# Altium schematic sheet main.SchDoc
size A3
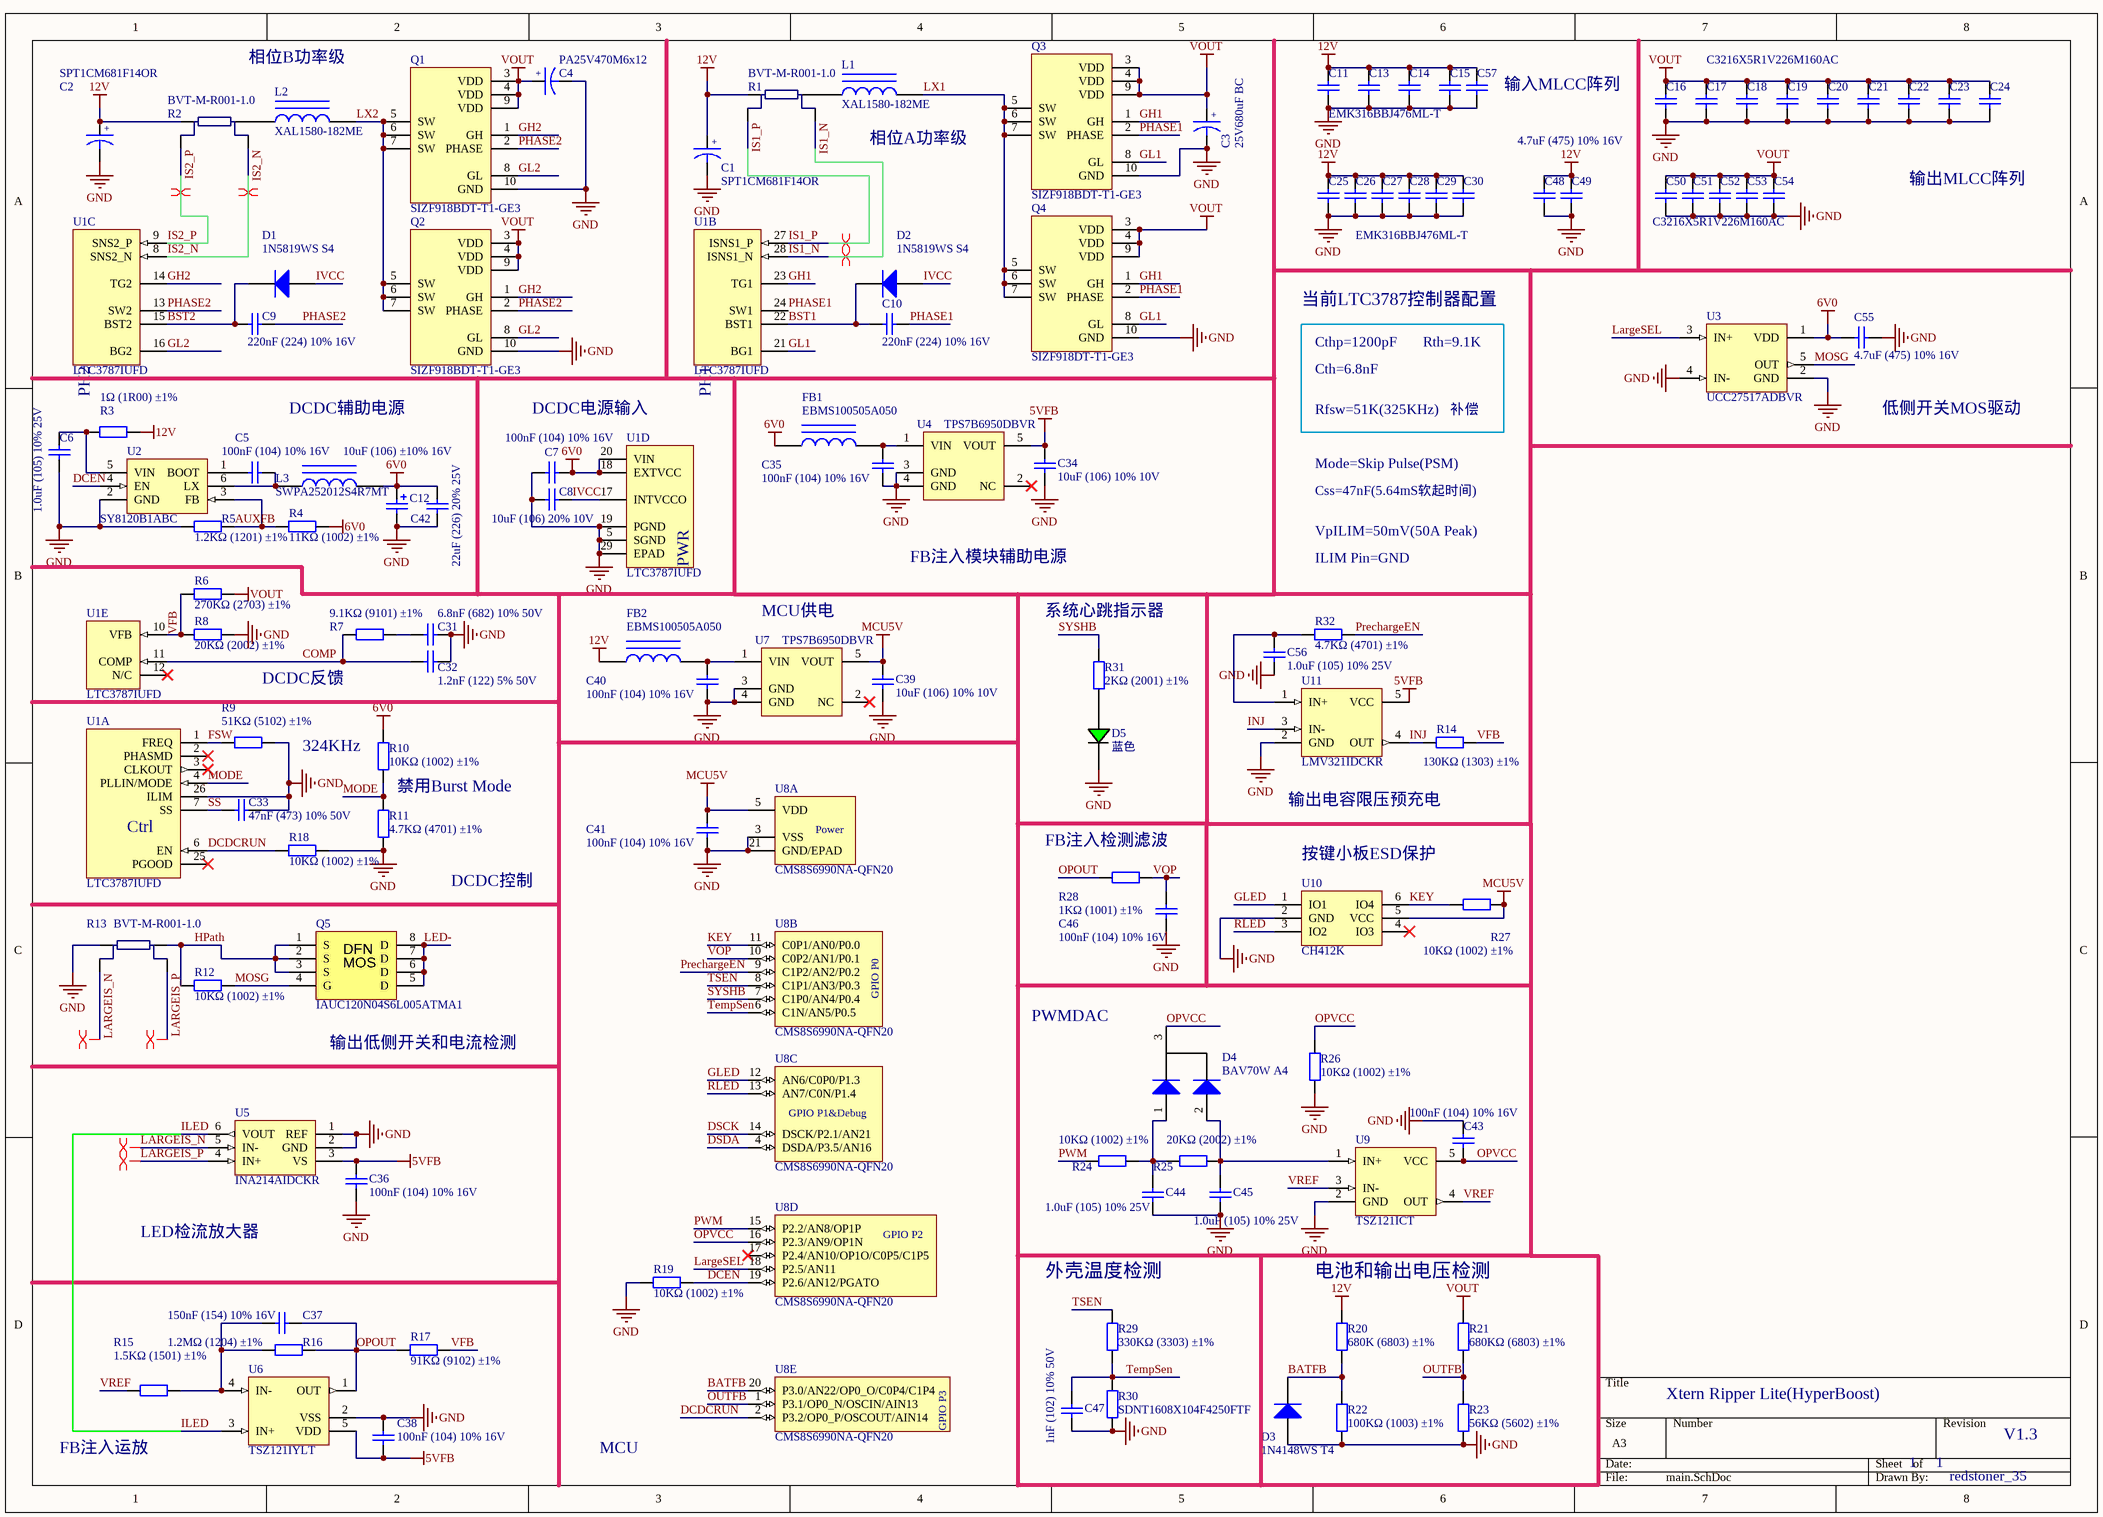
[diagram p0: main.SchDoc]

## Parts
C1  SPT1CM681F14OR  [ElecCap_Hori]
C2  SPT1CM681F14OR  [ElecCap_Hori]
C3  25V680uF BC  [ElecCap_Hori]
C4  PA25V470M6x12  [ElecCap_Hori]
C5  100nF (104) 10% 16V  [0402_C]
C6  1.0uF (105) 10% 25V  [0402_C]
C7  100nF (104) 10% 16V  [0402_C]
C8  10uF (106) 20% 10V  [0402_C]
C9  220nF (224) 10% 16V  [0402_C]
C10  220nF (224) 10% 16V  [0402_C]
C11  EMK316BBJ476ML-T  [1206C]
C12  10uF (106) ±10% 16V  [CASE-A_3216]
C13  EMK316BBJ476ML-T  [1206C]  (value not drawn)
C14  EMK316BBJ476ML-T  [1206C]  (value not drawn)
C15  EMK316BBJ476ML-T  [1206C]  (value not drawn)
C16  C3216X5R1V226M160AC  [1206C]
C17  C3216X5R1V226M160AC  [1206C]  (value not drawn)
C18  C3216X5R1V226M160AC  [1206C]  (value not drawn)
C19  C3216X5R1V226M160AC  [1206C]  (value not drawn)
C20  C3216X5R1V226M160AC  [1206C]  (value not drawn)
C21  C3216X5R1V226M160AC  [1206C]  (value not drawn)
C22  C3216X5R1V226M160AC  [1206C]  (value not drawn)
C23  C3216X5R1V226M160AC  [1206C]  (value not drawn)
C24  C3216X5R1V226M160AC  [1206C]  (value not drawn)
C25  EMK316BBJ476ML-T  [1206C]
C26  EMK316BBJ476ML-T  [1206C]  (value not drawn)
C27  EMK316BBJ476ML-T  [1206C]  (value not drawn)
C28  EMK316BBJ476ML-T  [1206C]  (value not drawn)
C29  EMK316BBJ476ML-T  [1206C]  (value not drawn)
C30  EMK316BBJ476ML-T  [1206C]  (value not drawn)
C31  6.8nF (682) 10% 50V  [0402_C]
C32  1.2nF (122) 5% 50V  [0402_C]
C33  47nF (473) 10% 50V  [0402_C]
C34  10uF (106) 10% 10V  [0603_C]
C35  100nF (104) 10% 16V  [0402_C]
C36  100nF (104) 10% 16V  [0402_C]
C37  150nF (154) 10% 16V  [0402_C]
C38  100nF (104) 10% 16V  [0402_C]
C39  10uF (106) 10% 10V  [0603_C]
C40  100nF (104) 10% 16V  [0402_C]
C41  100nF (104) 10% 16V  [0402_C]
C42  22uF (226) 20% 25V  [0805_C]
C43  100nF (104) 10% 16V  [0402_C]
C44  1.0uF (105) 10% 25V  [0402_C]
C45  1.0uF (105) 10% 25V  [0402_C]
C46  100nF (104) 10% 16V  [0402_C]
C47  1nF (102) 10% 50V  [0402_C]
C48  4.7uF (475) 10% 16V  [0603_C]  (value not drawn)
C49  4.7uF (475) 10% 16V  [0603_C]
C50  C3216X5R1V226M160AC  [1206C]
C51  C3216X5R1V226M160AC  [1206C]  (value not drawn)
C52  C3216X5R1V226M160AC  [1206C]  (value not drawn)
C53  C3216X5R1V226M160AC  [1206C]  (value not drawn)
C54  C3216X5R1V226M160AC  [1206C]  (value not drawn)
C55  4.7uF (475) 10% 16V  [0603_C]
C56  1.0uF (105) 10% 25V  [0402_C]
C57  EMK316BBJ476ML-T  [1206C]  (value not drawn)
D1  1N5819WS S4  [SOD-323]
D2  1N5819WS S4  [SOD-323]
D3  1N4148WS T4  [SOD-323]
D4  BAV70W A4  [SC70-3]
D5  蓝色  [LED-0402]
FB1  EBMS100505A050  [0402_L]
FB2  EBMS100505A050  [0402_L]
L1  XAL1580-182ME  [XAL1580_xxxME]
L2  XAL1580-182ME  [XAL1580_xxxME]
L3  SWPA252012S4R7MT  [SWPA252010S]
Q1  SIZF918BDT-T1-GE3  [AOE6936]
Q2  SIZF918BDT-T1-GE3  [AOE6936]
Q3  SIZF918BDT-T1-GE3  [AOE6936]
Q4  SIZF918DT-T1-GE3  [AOE6936]
Q5  IAUC120N04S6L005ATMA1  [SON/DFN5x6(MOS)]
R1  BVT-M-R001-1.0  [2512-Virtual4Wire]
R2  BVT-M-R001-1.0  [2512-Virtual4Wire]
R3  1Ω (1R00) ±1%  [0402_R]
R4  11KΩ (1002) ±1%  [0402_R]
R5  1.2KΩ (1201) ±1%  [0402_R]
R6  270KΩ (2703) ±1%  [0402_R]
R7  9.1KΩ (9101) ±1%  [0402_R]
R8  20KΩ (2002) ±1%  [0402_R]
R9  51KΩ (5102) ±1%  [0402_R]
R10  10KΩ (1002) ±1%  [0402_R]
R11  4.7KΩ (4701) ±1%  [0402_R]
R12  10KΩ (1002) ±1%  [0402_R]
R13  BVT-M-R001-1.0  [2512-Virtual4Wire]
R14  130KΩ (1303) ±1%  [0402_R]
R15  1.5KΩ (1501) ±1%  [0402_R]
R16  1.2MΩ (1204) ±1%  [0402_R]
R17  91KΩ (9102) ±1%  [0402_R]
R18  10KΩ (1002) ±1%  [0402_R]
R19  10KΩ (1002) ±1%  [0402_R]
R20  680K (6803) ±1%  [0402_R]
R21  680KΩ (6803) ±1%  [0402_R]
R22  100KΩ (1003) ±1%  [0402_R]
R23  56KΩ (5602) ±1%  [0402_R]
R24  10KΩ (1002) ±1%  [0402_R]
R25  20KΩ (2002) ±1%  [0402_R]
R26  10KΩ (1002) ±1%  [0402_R]
R27  10KΩ (1002) ±1%  [0402_R]
R28  1KΩ (1001) ±1%  [0402_R]
R29  330KΩ (3303) ±1%  [0402_R]
R30  SDNT1608X104F4250FTF  [0603_R]
R31  2KΩ (2001) ±1%  [0402_R]
R32  4.7KΩ (4701) ±1%  [0402_R]
U1  LTC3787IUFD  [UFD-QFN28]  (parts A,B,C,D,E of 5)
U2  SY8120B1ABC  [SOT95P245X110-6N]
U3  UCC27517ADBVR  [SOT95P245X110-5N]
U4  TPS7B6950DBVR  [SOT95P245X110-5N]
U5  INA214AIDCKR  [SC70-6]
U6  TSZ121IYLT  [SOT95P245X110-5N]
U7  TPS7B6950DBVR  [SOT95P245X110-5N]
U8  CMS8S6990NA-QFN20  [QFN40P300X300X800_HS-21N]  (parts A,B,C,D,E of 5)
U9  TSZ121ICT  [SC70-5]
U10  CH412K  [SC70-6]
U11  LMV321IDCKR  [SC70-5]

## Nets
5VFB: C34.2 C36.2 C38.1 U4.5(VOUT) U5.3(VS) U6.5(VDD) U11.5(VCC)
6V0: C7.2 C12.1 C42.2 C55.1 FB1.1 L3.1 R4.1 R10.2 U1.18(EXTVCC) U1.20(VIN) U3.1(VDD)
12V: C1.1 C2.1 C11.2 C13.2 C14.2 C15.2 C25.2 C26.2 C27.2 C28.2 C29.2 C30.2 C48.2 C49.2 C57.2 FB2.1 R1.0(CIN) R2.1(CIN) R3.2 R20.2
GND: C1.2 C2.2 C3.2 C4.2 C6.1 C7.1 C8.1 C11.1 C12.2 C13.1 C14.1 C15.1 C16.1 C17.1 C18.1 C19.1 C20.1 C21.1 C22.1 C23.1 C24.1 C25.1 C26.1 C27.1 C28.1 C29.1 C30.1 C31.2 C32.1 C33.2 C34.1 C35.1 C36.1 C38.2 C39.1 C40.1 C41.1 C42.1 C43.1 C44.1 C45.1 C46.1 C47.1 C48.1 C49.1 C50.1 C51.1 C52.1 C53.1 C54.1 C55.2 C56.1 C57.1 D3.1(A) D5.K Q1.10(GND) Q2.10(GND) Q3.10(GND) Q4.10(GND) R5.2 R8.2 R9.2 R11.1 R13.0(CIN) R18.2 R19.1 R22.1 R23.1 R26.1 R30.2 U1.5(SGND) U1.19(PGND) U1.26(ILIM) U1.29(EPAD) U2.2(GND) U3.2(GND) U3.4(IN-) U4.3(GND) U4.4(GND) U5.1(REF) U5.2(GND) U6.2(VSS) U7.3(GND) U7.4(GND) U8.3(VSS) U8.21(GND/EPAD) U9.2(GND) U10.2(GND) U11.2(GND)
MCU5V: C39.2 C41.2 R27.2 U7.5(VOUT) U8.5(VDD) U10.5(VCC)
VOUT: C3.1 C4.1 C16.2 C17.2 C18.2 C19.2 C20.2 C21.2 C22.2 C23.2 C24.2 C50.2 C51.2 C52.2 C53.2 C54.2 Q1.3(VDD) Q1.4(VDD) Q1.9(VDD) Q2.3(VDD) Q2.4(VDD) Q2.9(VDD) Q3.3(VDD) Q3.4(VDD) Q3.9(VDD) Q4.3(VDD) Q4.4(VDD) Q4.9(VDD) R6.2 R21.2
AUXFB: R4.2 R5.1 U2.3(FB)
BATFB: D3.2(K) R20.1 R22.2 U8.20(P3.0/AN22/OP0_O/C0P4/C1P4)
BST1: C10.1 D2.2(K) U1.22(BST1)
BST2: C9.1 D1.2(K) U1.15(BST2)
COMP: C32.2 R7.1 U1.11(COMP)
DCDCRUN: R18.1 U1.6(EN) U8.2(P3.2/OP0_P/OSCOUT/AIN14)
DCEN: R19.2 U2.4(EN) U8.19(P2.6/AN12/PGATO)
DSCK: U8.14(DSCK/P2.1/AN21)
DSDA: U8.4(DSDA/P3.5/AN16)
FSW: R9.1 U1.1(FREQ)
GH1: Q3.1(GH) Q4.1(GH) U1.23(TG1)
GH2: Q1.1(GH) Q2.1(GH) U1.14(TG2)
GL1: Q3.8(GL) Q4.8(GL) U1.21(BG1)
GL2: Q1.8(GL) Q2.8(GL) U1.16(BG2)
GLED: U8.12(AN6/C0P0/P1.3) U10.1(IO1)
HPath: Q5.1(S) Q5.2(S) Q5.3(S) R12.2 R13.1(CIN)
ILED: U5.6(VOUT) U6.3(IN+)
INJ: R14.1 U11.3(IN-) U11.4(OUT)
IS1_N: R1.3(CIN) U1.28(ISNS1_N)
IS1_P: R1.2(CIN) U1.27(ISNS1_P)
IS2_N: R2.2(CIN) U1.8(SNS2_N)
IS2_P: R2.3(CIN) U1.9(SNS2_P)
IVCC: C8.2 D1.1(A) D2.1(A) U1.17(INTVCCO)
KEY: R27.1 U8.11(C0P1/AN0/P0.0) U10.6(IO4)
LARGEIS_N: R13.2(CIN) U5.5(IN-)
LARGEIS_P: R13.3(CIN) U5.4(IN+)
LargeSEL: U3.3(IN+) U8.18(P2.5/AN11)
LED-: Q5.5(D) Q5.6(D) Q5.7(D) Q5.8(D)
LX1: L1.2 Q3.5(SW) Q3.6(SW) Q3.7(SW) Q4.5(SW) Q4.6(SW) Q4.7(SW)
LX2: L2.2 Q1.5(SW) Q1.6(SW) Q1.7(SW) Q2.5(SW) Q2.6(SW) Q2.7(SW)
MODE: R10.1 R11.2 U1.4(PLLIN/MODE)
MOSG: Q5.4(G) R12.1 U3.5(OUT)
OPOUT: C37.2 R16.2 R17.1 R28.1 U6.1(OUT)
OPVCC: C43.2 D4.3(K) R26.2 U8.16(P2.3/AN9/OP1N) U9.5(VCC)
OUTFB: R21.1 R23.2 U8.1(P3.1/OP0_N/OSCIN/AIN13)
PHASE1: C10.2 Q3.2(PHASE) Q4.2(PHASE) U1.24(SW1)
PHASE2: C9.2 Q1.2(PHASE) Q2.2(PHASE) U1.13(SW2)
PrechargeEN: R32.2 U8.9(C1P2/AN2/P0.2)
PWM: R24.1 U8.15(P2.2/AN8/OP1P)
RLED: U8.13(AN7/C0N/P1.4) U10.3(IO2)
SS: C33.1 U1.7(SS)
SYSHB: R31.2 U8.7(C1P0/AN4/P0.4)
TempSen: C47.2 R29.1 R30.1 U8.6(C1N/AN5/P0.5)
TSEN: R29.2 U8.8(C1P1/AN3/P0.3)
VFB: R6.1 R8.1 R14.2 R17.2 U1.10(VFB)
VOP: C46.2 R28.2 U8.10(C0P2/AN1/P0.1)
VREF: R15.1 U9.3(IN-) U9.4(OUT)
NetC5_1: C5.1 L3.2 U2.6(LX)
NetC5_2: C5.2 U2.1(BOOT)
NetC6_2: C6.2 R3.1 U2.5(VIN)
NetC31_1: C31.1 R7.2
NetC35_2: C35.2 FB1.2 U4.1(VIN)
NetC37_1: C37.1 R15.2 R16.1 U6.4(IN-)
NetC40_2: C40.2 FB2.2 U7.1(VIN)
NetC44_2: C44.2 D4.1(A) R24.2 R25.1
NetC45_2: C45.2 D4.2(A) R25.2 U9.1(IN+)
NetC56_2: C56.2 R32.1 U11.1(IN+)
NetD5_A: D5.A R31.1
NetL1_1: L1.1 R1.1(CIN)
NetL2_1: L2.1 R2.0(CIN)

Not connected (* = marked no-connect by the designer): U1 2(PHASMD)* 3(CLKOUT)* 12(N/C)* 25(PGOOD)*; U4 2(NC)*; U7 2(NC)*; U8 17(P2.4/AN10/OP1O/C0P5/C1P5)*; U10 4(IO3)*

## Layout directives
differential pair: IS1_N, IS1_P, IS2_N, IS2_P, LARGEIS_N, LARGEIS_P

## Notes on the sheet
- 相位B功率级
- (near C57) 输入MLCC阵列
- (near L1) 相位A功率级
- 输出MLCC阵列
- 当前LTC3787控制器配置
- Cthp=1200pF
- Cth=6.8nF
- Rth=9.1K
- DCDC辅助电源
- DCDC电源输入
- Rfsw=51K(325KHz)
- 补偿
- 低侧开关MOS驱动
- Mode=Skip Pulse(PSM)
- Css=47nF(5.64mS软起时间)
- FB注入模块辅助电源
- VpILIM=50mV(50A Peak)
- ILIM Pin=GND
- (near U7) MCU供电
- (near R31) 系统心跳指示器
- DCDC反馈
- 324KHz
- 禁用Burst Mode
- (near R28) FB注入检测滤波
- (near U11) 输出电容限压预充电
- (near U10) 按键小板ESD保护
- DCDC控制
- (near Q5) 输出低侧开关和电流检测
- PWMDAC
- LED检流放大器
- (near R29) 外壳温度检测
- 电池和输出电压检测
- Xtern Ripper Lite(HyperBoost)
- FB注入运放
- MCU
- 1
- V1.3
- redstoner_35
- (in symbol CAP2) +
- (in symbol CM8S6990NA-QFN20, part A) Power
- (in symbol CM8S6990NA-QFN20, part B) GPIO P0
- (in symbol CM8S6990NA-QFN20, part C) GPIO P1&Debug
- (in symbol CM8S6990NA-QFN20, part D) GPIO P2
- (in symbol CM8S6990NA-QFN20, part E) GPIO P3
- (in symbol LTC3787IUFD, part A) Ctrl
- (in symbol LTC3787IUFD, part B) PH1
- (in symbol LTC3787IUFD, part C) PH2
- (in symbol LTC3787IUFD, part D) PWR
- (in symbol SON/DFN5x6 MOS) DFN; MOS

## Library data of the parts
C1 C2 = CAP2: 直插固态电容，耐压16V容量680uF，尺寸6x11
C3 = CAP2: 绿宝石直插固态电容 680uF 25V BC系列，体积6x15
C4 = CAP2: 105°C 2000Hrs 直插固态电容。耐压25V容量470uF，尺寸D6.3mmxL12mm
C5 C7 C33 C35-C38 C40 C41 C43 C46 = 0402 100nF (104) 10% 16V: 贴片电容; ComponentLink1Description: 供应商链接; ComponentLink1URL: http://www.szlcsc.com/product/details_1877.html; Package: 0402; Supplier: LC; SuppliersPartNumber: C1525
C6 C44 C45 C56 = 0402 1.0uF (105) 10% 25V: 贴片电容; ComponentLink1Description: 供应商链接; ComponentLink1URL: http://www.szlcsc.com/product/details_53938.html; Package: 0402; Supplier: LC; SuppliersPartNumber: C52923
C8 = 0402 10uF (106) 20% 6.3V: 贴片电容; ComponentLink1Description: 供应商链接; ComponentLink1URL: http://www.szlcsc.com/product/details_16204.html; Package: 0402; Supplier: LC; SuppliersPartNumber: C15525
C9 C10 = 0402 220nF (224) 10% 16V: 贴片电容; ComponentLink1Description: 供应商链接; ComponentLink1URL: http://www.szlcsc.com/product/details_17456.html; Package: 0402; Supplier: LC; SuppliersPartNumber: C16772
C11 C13-C15 C25-C30 C57 = Cap: 1206尺寸太诱MLCC 16V 47uF X5R ±20%; Value: 22uF; Published: 8-Jun-2000; LatestRevisionDate: 17-Jul-2002; LatestRevisionNote: Re-released for DXP Platform.; PackageReference: RAD-0.3; Publisher: Altium Limited; PackageDescription: Radial Cap, Thru-Hole; 2 Leads; 0.3 in Pin Spacing
C12 = 3216 10uF (106) 10% 16V: 钽电容; ComponentLink1Description: 供应商链接; ComponentLink1URL: http://www.szlcsc.com/product/details_7643.html; Package: 3216; Supplier: LC; SuppliersPartNumber: C7171
C16-C24 C50-C54 = Cap: 1206尺寸TDK MLCC 35V 22uF; Published: 8-Jun-2000; LatestRevisionDate: 17-Jul-2002; LatestRevisionNote: Re-released for DXP Platform.; PackageReference: RAD-0.3; Publisher: Altium Limited; PackageDescription: Radial Cap, Thru-Hole; 2 Leads; 0.3 in Pin Spacing; Value: 22uF
C31 = 0402 6.8nF (682) 10% 50V: 贴片电容; ComponentLink1Description: 供应商链接; ComponentLink1URL: http://www.szlcsc.com/product/details_1894.html; Package: 0402; Supplier: LC; SuppliersPartNumber: C1542
C32 = 0402 100pF (101) 5% 50V: 贴片电容; ComponentLink1Description: 供应商链接; ComponentLink1URL: http://www.szlcsc.com/product/details_1898.html; Package: 0402; Supplier: LC; SuppliersPartNumber: C1546
C34 C39 = 0603 10uF (106) 10% 10V: 贴片电容; ComponentLink1Description: 供应商链接; ComponentLink1URL: http://www.szlcsc.com/product/details_20411.html; Package: 0603; Supplier: LC; SuppliersPartNumber: C19702
C42 = 0805 22uF (226) 20% 25V: 贴片电容; ComponentLink1Description: 供应商链接; ComponentLink1URL: http://www.szlcsc.com/product/details_46786.html; Package: 0805; Supplier: LC; SuppliersPartNumber: C45783
C47 = 0402 1nF (102) 10% 50V: 贴片电容; ComponentLink1Description: 供应商链接; ComponentLink1URL: http://www.szlcsc.com/product/details_1875.html; Package: 0402; Supplier: LC; SuppliersPartNumber: C1523
C48 C49 C55 = 0603 4.7uF (475) 10% 16V: 贴片电容; ComponentLink1Description: 供应商链接; ComponentLink1URL: http://www.szlcsc.com/product/details_20375.html; Package: 0603; Supplier: LC; SuppliersPartNumber: C19666
D1-D3 = SOD-323 1N4148WS T4: 二极管; ComponentLink1Description: 供应商链接; ComponentLink1URL: http://www.szlcsc.com/product/details_2485.html; Package: SOD-323; Supplier: LC; SuppliersPartNumber: C2128
D4 = SOT-23 BAV70 A4: 开关二极管; ComponentLink1Description: 供应商链接; ComponentLink1URL: http://www.szlcsc.com/product/details_70091.html; Package: SOT-23; Supplier: LC; SuppliersPartNumber: C68978
D5 = LED0402: 0402(1005)贴片发光二极管; Color: 蓝色
FB1 FB2 = 0402 12nH  5%: 贴片磁珠 200mA 5R±25% 100MHz; ComponentLink1Description: 供应商链接; ComponentLink1URL: http://www.szlcsc.com/product/details_25303.html; Package: 0402; Supplier: LC; SuppliersPartNumber: C24563
L1 L2 = Inductor Iron: 线艺XAL系列电感; Value: 1.8uH; Published: 24-Mar-1999; LatestRevisionDate: 17-Jul-2002; LatestRevisionNote: Re-released for DXP Platform.; PackageReference: AXIAL-0.9; Publisher: Altium Limited; PackageDescription: Axial Device, Thru-Hole; 2 Leads; 0.9 in Pin Spacing
L3 = Inductor Iron: 线绕功率电感 2.5x2.0mm尺寸 1.2mm高度; Value: 4.7uH; Published: 24-Mar-1999; LatestRevisionDate: 17-Jul-2002; LatestRevisionNote: Re-released for DXP Platform.; PackageReference: AXIAL-0.9; Publisher: Altium Limited; PackageDescription: Axial Device, Thru-Hole; 2 Leads; 0.9 in Pin Spacing
Q1-Q4 = AOE6936: 30V Dual N-Channel 30 V (D-S) MOSFET With Schottky Diodes 3.6/1.5mΩ RdsON
Q5 = SON/DFN5x6 MOS: 0.5mΩ 120A 40V OptiMOS 6 车规级MOSFET
R1 R2 R13 = shunt: 德国伊萨精密检流电阻，2512 1mΩ±1% 锰铜材质 <50ppm/K P70℃=3W
R3 = 0402 1Ω (1R00) 1%: 贴片电阻; ComponentLink1Description: 供应商链接; ComponentLink1URL: http://www.szlcsc.com/product/details_25829.html; Package: 0402; Supplier: LC; SuppliersPartNumber: C25086
R4 R5 R7 R10 R12 R18 R19 R24 R26 R27 = 0402 10KΩ (1002) 1%: 贴片电阻; ComponentLink1Description: 供应商链接; ComponentLink1URL: http://www.szlcsc.com/product/details_26487.html; Package: 0402; Supplier: LC; SuppliersPartNumber: C25744
R6 R14 R17 R22 R23 = 0402 100KΩ (1003) 1%: 贴片电阻; ComponentLink1Description: 供应商链接; ComponentLink1URL: http://www.szlcsc.com/product/details_26484.html; Package: 0402; Supplier: LC; SuppliersPartNumber: C25741
R8 = 0402 18KΩ (1802) 1%: 贴片电阻; ComponentLink1Description: 供应商链接; ComponentLink1URL: http://www.szlcsc.com/product/details_26505.html; Package: 0402; Supplier: LC; SuppliersPartNumber: C25762
R9 = 0402 56KΩ (5602) 1%: 贴片电阻; ComponentLink1Description: 供应商链接; ComponentLink1URL: http://www.szlcsc.com/product/details_26539.html; Package: 0402; Supplier: LC; SuppliersPartNumber: C25796
R11 = 0402 4.7KΩ (4701) 1%: 贴片电阻; ComponentLink1Description: 供应商链接; ComponentLink1URL: http://www.szlcsc.com/product/details_26643.html; Package: 0402; Supplier: LC; SuppliersPartNumber: C25900
R15 = 0402 470Ω (4700) 1%: 贴片电阻; ComponentLink1Description: 供应商链接; ComponentLink1URL: http://www.szlcsc.com/product/details_25860.html; Package: 0402; Supplier: LC; SuppliersPartNumber: C25117
R16 = 0402 1MΩ (1004) 1%: 贴片电阻; ComponentLink1Description: 供应商链接; ComponentLink1URL: http://www.szlcsc.com/product/details_26826.html; Package: 0402; Supplier: LC; SuppliersPartNumber: C26083
R20 = 0402 680Ω (6800) 1%: 贴片电阻; ComponentLink1Description: 供应商链接; ComponentLink1URL: http://www.szlcsc.com/product/details_25873.html; Package: 0402; Supplier: LC; SuppliersPartNumber: C25130
R21 = 0402 470KΩ (4703) 1%: 贴片电阻; ComponentLink1Description: 供应商链接; ComponentLink1URL: http://www.szlcsc.com/product/details_26533.html; Package: 0402; Supplier: LC; SuppliersPartNumber: C25790
R25 R32 = 0402 20KΩ (2002) 1%: 贴片电阻; ComponentLink1Description: 供应商链接; ComponentLink1URL: http://www.szlcsc.com/product/details_26508.html; Package: 0402; Supplier: LC; SuppliersPartNumber: C25765
R28 = 0402 1KΩ (1001) 1%: 贴片电阻; ComponentLink1Description: 供应商链接; ComponentLink1URL: http://www.szlcsc.com/product/details_12256.html; Package: 0402; Supplier: LC; SuppliersPartNumber: C11702
R29 = 0402 330KΩ (3303) 1%: 贴片电阻; ComponentLink1Description: 供应商链接; ComponentLink1URL: http://www.szlcsc.com/product/details_26521.html; Package: 0402; Supplier: LC; SuppliersPartNumber: C25778
R30 = 0603 100KΩ (1003) 1%: 0603贴片NTC热敏电阻，100KΩ (1003) ±1% B4250; ComponentLink1Description: 供应商链接; ComponentLink1URL: http://www.szlcsc.com/product/details_26546.html; Package: 0603; Supplier: LC; SuppliersPartNumber: C95955
R31 = 0402 2KΩ (2001) 1%: 贴片电阻; ComponentLink1Description: 供应商链接; ComponentLink1URL: http://www.szlcsc.com/product/details_4516.html; Package: 0402; Supplier: LC; SuppliersPartNumber: C4109
U1 = LTC3787IUFD: PolyPhase Synchronous Boost Controller for 2 Phases
U2 = SY8120: 2A输出电流，18V耐压同步降压转换器，SOT-23-6封装
U3 = UCC27517ADBVR: 4A Gate Driver SOT-23 Low side
U4 U7 = TPS7B6933DBVR: 150mA 40V max input Ultra low Iq LDO,fixed 5V output
U5 = INA199A2DCKR: 100V/V增益 26V最高共模电压，高低测通用双向高精度检流放大器 SC70-6封装
U6 = TLV333IDBVR: 高精度零漂移低功耗5V运放 400Khz GBW SOT23-5封装
U8 = CM8S6990NA-QFN20: 增强型闪存1T 8051单片机，16KB Flash 256+1K XRAM
U9 = LMV321IDCKR: 高精度零漂移低功耗5V运放 400Khz GBW SC70-5封装
U10 = CH412K: very low capacity quad IO ESD protection Array
U11 = LMV321IDCKR: CMOS超小型运算放大器，SC70-5